# Altium project Currrent_Sense.PrjPCB
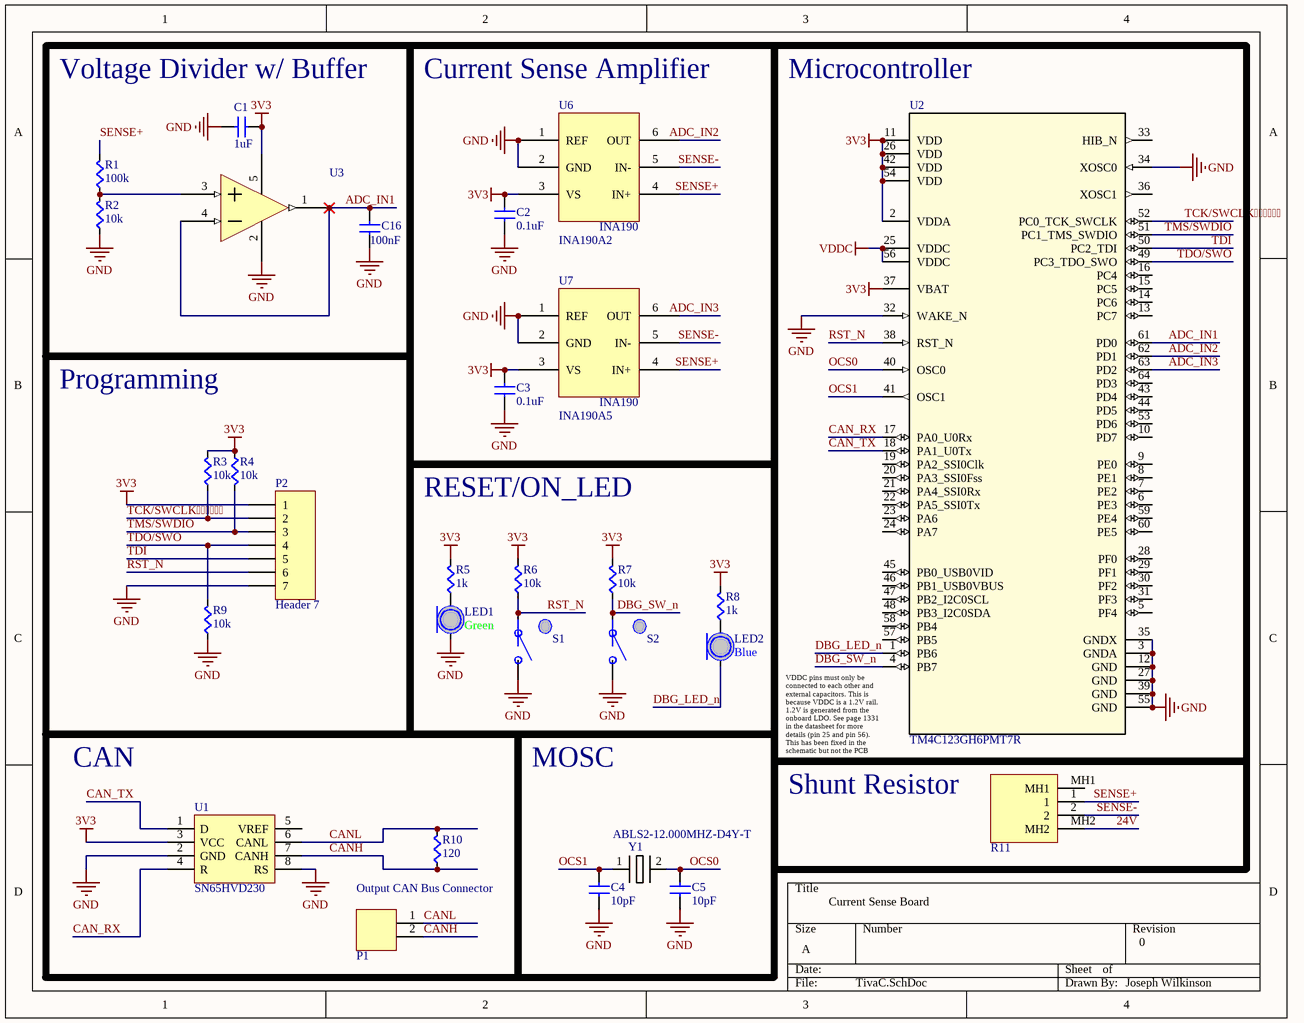
[diagram p0: TivaC.SchDoc]
2 sheets, 59 parts. Net scope: global (net labels, ports and power ports of the same name join across sheets).
Board file: Current_Sense_Board_V1.PcbDoc
Sheets:
  TivaC.SchDoc
  Power.SchDoc

## Sheet TivaC.SchDoc
size A

### Parts
C1  value 1uF  [CAPC0603]  (hidden comment: Cap)
C2  value 0.1uF  [CAPC0603]  (hidden comment: Cap)
C3  value 0.1uF  [CAPC0603]  (hidden comment: Cap)
C4  value 10pF  [CAPC0603]  (hidden comment: Cap)
C5  value 10pF  [CAPC0603]  (hidden comment: Cap)
C16  value 100nF  [CAPC0603]  (hidden comment: Cap)
LED1  Color: Green  [LED0603]  (hidden comment: LED)
LED2  Color: Blue  [LED0603]  (hidden comment: LED)
P1  2-pin Vert Sherlock  [MOLEX-HDR-1X2-SHERLOCK-VERT]  (value not drawn)
P2  Header 7  [HDR1X7]
R1  value 100k  [RES0603]  (hidden comment: Res)
R2  value 10k  [RES0603]  (hidden comment: Res)
R3  value 10k  [RES0603]  (hidden comment: Res)
R4  value 10k  [RES0603]  (hidden comment: Res)
R5  value 1k  [RES0603]  (hidden comment: Res)
R6  value 10k  [RES0603]  (hidden comment: Res)
R7  value 10k  [RES0603]  (hidden comment: Res)
R8  value 1k  [RES0603]  (hidden comment: Res)
R9  value 10k  [RES0603]  (hidden comment: Res)
R10  value 120  [RES0603]  (hidden comment: Res)
R11  SH6918F500BPEP  [SH6918F500BPEP]  (value not drawn)
S1  Button  [PTS645xxxxSMTR92]  (value not drawn)
S2  Button  [PTS645xxxxSMTR92]  (value not drawn)
U1  SN65HVD230  [SOIC-8pin]
U2  TM4C123GH6PMT7R  [TM4C123GH6PMT7R_L]
U3  MCP6L01  [MCP6L01R]  (value not drawn)
U6  INA190A2  [SC70 (DCK)]
U7  INA190A5  [SC70 (DCK)]
Y1  ABLS2-12.000MHZ-D4Y-T  [HC49/US]

### Blocks framed on the sheet
Voltage Divider w/ Buffer: C1 C16 R1 R2 U3
Current Sense Amplifier: C2 C3 U6 U7
Microcontroller: U2
Programming: P2 R3 R4 R9
RESET/ON_LED: LED1 LED2 R5-R8 S1 S2
CAN: P1 R10 U1
MOSC: C4 C5 Y1
Shunt Resistor: R11

### Nets
3V3: C1.2(B) C2.1(A) C3.1(A) P2.1 R3.1(A) R4.2(B) R5.1(A) R6.1(A) R7.1(A) R8.1(A) U1.3(VCC) U2.2(VDDA) U2.11(VDD) U2.26(VDD) U2.37(VBAT) U2.42(VDD) U2.54(VDD) U3.5(VDD) U6.3(VS) U7.3(VS)
GND: C1.1(A) C2.2(B) C3.2(B) C4.2(B) C5.2(B) C16.2(B) LED1.C P2.7 R2.2(B) R9.2(B) S1.B S2.B U1.2(GND) U1.8(RS) U2.3(GNDA) U2.12(GND) U2.27(GND) U2.32(WAKE_N) U2.34(XOSC0) U2.35(GNDX) U2.39(GND) U2.55(GND) U3.2(VSS) U6.1(REF) U6.2(GND) U7.1(REF) U7.2(GND)
VDDC: U2.25(VDDC) U2.56(VDDC)
24V: R11.MH2
ADC_IN1: C16.1(A) U2.61(PD0) U3.1(VOUT) U3.4(VIN-)
ADC_IN2: U2.62(PD1) U6.6(OUT)
ADC_IN3: U2.63(PD2) U7.6(OUT)
CAN_RX: U1.4(R) U2.17(PA0_U0Rx)
CAN_TX: U1.1(D) U2.18(PA1_U0Tx)
CANH: P1.2 R10.2(B) U1.7(CANH)
CANL: P1.1 R10.1(A) U1.6(CANL)
DBG_LED_n: LED2.C U2.1(PB6)
DBG_SW_n: R7.2(B) S2.A U2.4(PB7)
OCS0: C5.1(A) U2.40(OSC0) Y1.2
OCS1: C4.1(A) U2.41(OSC1) Y1.1
RST_N: P2.6 R6.2(B) S1.A U2.38(RST_N)
SENSE+: R1.1(A) R11.1 U6.4(IN+) U7.4(IN+)
SENSE-: R11.2 U6.5(IN-) U7.5(IN-)
TCK/SWCLK: P2.2 R3.2(B) U2.52(PC0_TCK_SWCLK)
TDI: P2.5 U2.50(PC2_TDI)
TDO/SWO: P2.4 R9.1(A) U2.49(PC3_TDO_SWO)
TMS/SWDIO: P2.3 R4.1(A) U2.51(PC1_TMS_SWDIO)
NetLED1_A: LED1.A R5.2(B)
NetLED2_A: LED2.A R8.2(B)
NetR1_2: R1.2(B) R2.1(A) U3.3(VIN+)

Not connected (* = marked no-connect by the designer): R11 MH1; U1 5(VREF); U2 5(PF4) 6(PE3) 7(PE2) 8(PE1) 9(PE0) 10(PD7) 13(PC7) 14(PC6) 15(PC5) 16(PC4) 19(PA2_SSI0Clk) 20(PA3_SSI0Fss) 21(PA4_SSI0Rx) 22(PA5_SSI0Tx) 23(PA6) 24(PA7) 28(PF0) 29(PF1) 30(PF2) 31(PF3) 33(HIB_N) 36(XOSC1) 43(PD4) 44(PD5) 45(PB0_USB0VID) 46(PB1_USB0VBUS) 47(PB2_I2C0SCL) 48(PB3_I2C0SDA) 53(PD6) 57(PB5) 58(PB4) 59(PE4) 60(PE5) 64(PD3)

### Notes on the sheet
- (near U2) VDDC pins must only be connected to each other and external capacitors. This is because VDDC is a 1.2V rail. 1.2V is generated from the onboard LDO. See page 1331 in the datasheet for more details (pin 25 and pin 56). This has been fixed in the schematic but not the PCB layout.
- Output CAN Bus Connector
- Current Sense Board
- 0
- Joseph Wilkinson

### Library data of the parts
P1 = MOLEX-HDR-1x2-SHERLOCK_VERT: Header, Molex, 2mm Pitch Sherlock Header, Single Row, Vertical, 2 Circuits, Length 3.3mm, 0353620250; Manufacturer Part Number: *; Order Part Number: *
P2 = Header 7: Header, 7-Pin; LatestRevisionDate: 17-Jul-2002; LatestRevisionNote: Re-released for DXP Platform.; Publisher: Altium Limited
R11 = SH6918F500BPEP: Copper bus bar with shunt resistor integrated; Manufacturer_Name: Ohmite; Height: 3.2mm; Manufacturer_Part_Number: SH6918F500BPEP; Mouser Part Number: 588-SH6918F500BPEP; Mouser Price/Stock: https://www.mouser.co.uk/ProductDetail/Ohmite/SH6918F500BPEP?qs=GedFDFLaBXHzBT0hI2BMgQ%3D%3D
S1 S2 = Button: SPST Button; Supplier 1: Digi-Key; Supplier Part Number 1: CKN9087CT-ND
U1 = SN65HVD230: 3.3V CAN Bus Transceiver
U2 = TM4C123GH6PMT7R: Imported; PartNumber: TM4C123GH6PMTR; Manufacturer: Texas Instruments; CompType: IC; PIN_COUNT: 64; Application_BuildNumber: *; Alternate_PartNumber: TM4C123GH6PMT; PackageReference: PM0064A; MountType: SMT; RoHS: Y; RefDes: RefDes; TYPE: TYPE; Value: Value
U3 = MCP6L01: Op Amp Rail-to-Rail 1Mhz; Supplier 1: Digi-Key; Supplier Part Number 1: MCP6L01T-E/OTCT-ND
U6 U7 = INA190
Y1 = ABLS2-12.000MHZ-D4Y-T: 12MHz ±30ppm Crystal 18pF 50 Ohm -40°C ~ 85°C Surface Mount HC49/US; Supplier 1: Digi-Key; Supplier Part Number 1: 535-9869-1-ND
C1-C5 C16 = Cap: Supplier 1: Digi-Key; Supplier Part Number 1: 1276-1000-1-ND
LED1 LED2 = LED: Supplier 1: Digi-Key; Supplier Part Number 1: 754-1122-1-ND
R1-R10 = Res: Supplier 1: Digi-Key; Supplier Part Number 1: RMCF0603JT10K0CT-ND

## Sheet Power.SchDoc
size A
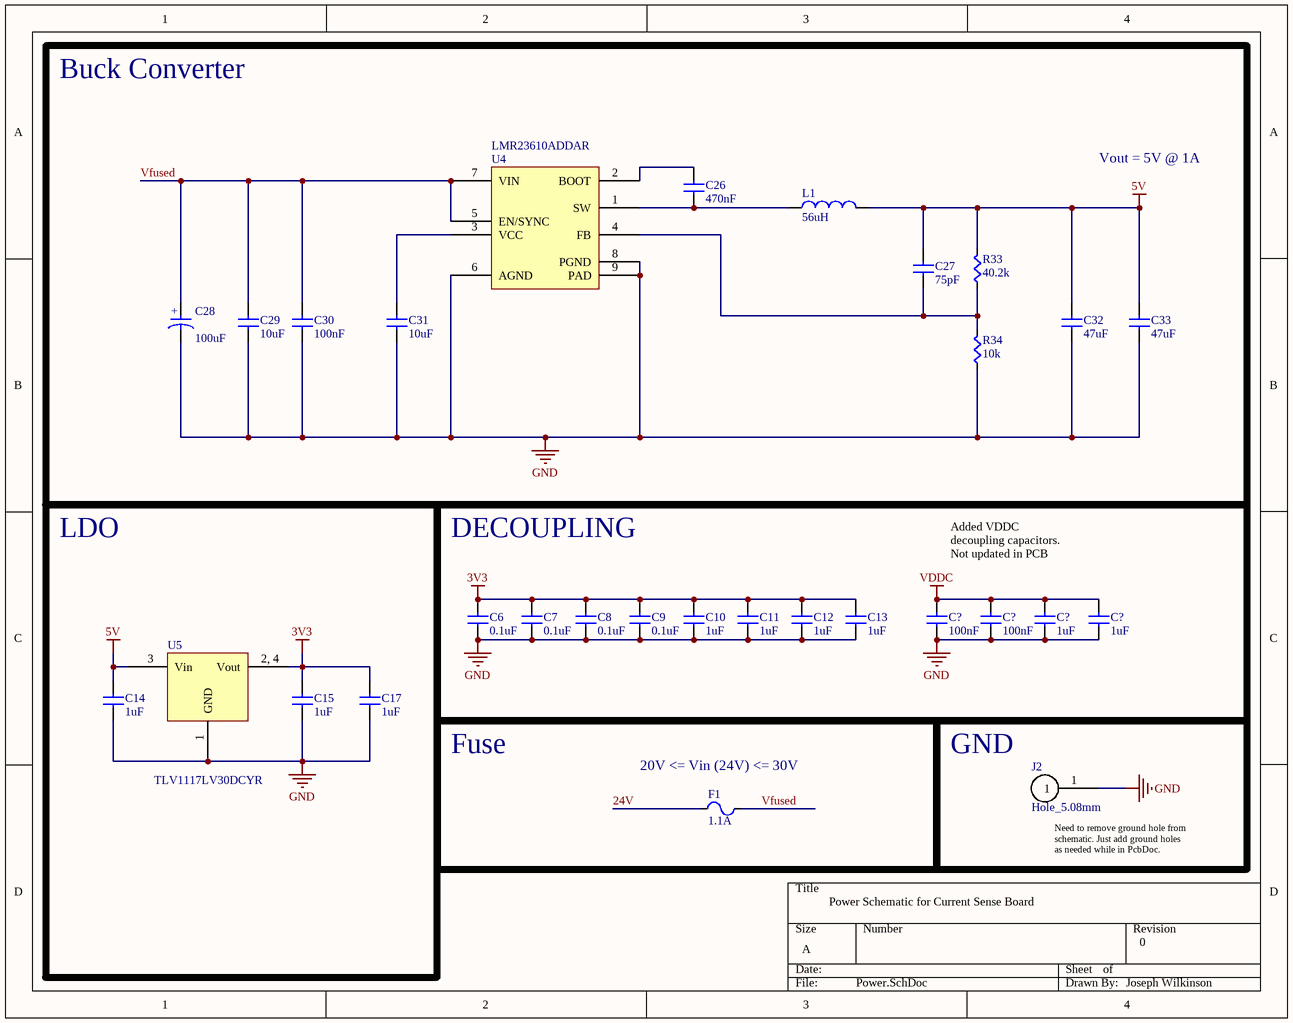
[diagram p1: Power.SchDoc]

### Parts
(Parts that share a designator on the sheet are numbered #1, #2 ... from top to bottom, then left to right.)
C6  value 0.1uF  [CAPC0603]  (hidden comment: Cap)
C7  value 0.1uF  [CAPC0603]  (hidden comment: Cap)
C8  value 0.1uF  [CAPC0603]  (hidden comment: Cap)
C9  value 0.1uF  [CAPC0603]  (hidden comment: Cap)
C10  value 1uF  [CAPC0603]  (hidden comment: Cap)
C11  value 1uF  [CAPC0603]  (hidden comment: Cap)
C12  value 1uF  [CAPC0603]  (hidden comment: Cap)
C13  value 1uF  [CAPC0603]  (hidden comment: Cap)
C14  value 1uF  [CAPC0603]  (hidden comment: Cap)
C15  value 1uF  [CAPC0603]  (hidden comment: Cap)
C17  value 1uF  [CAPC0603]  (hidden comment: Cap)
C26  value 470nF  [CAPC0603]  (hidden comment: Cap)
C27  value 75pF  [CAPC0603]  (hidden comment: Cap)
C28  value 100uF  [MAL215097101E3]  (hidden comment: MAL215097101E3)
C29  value 10uF  [CAPC1206]  (hidden comment: Cap)
C30  value 100nF  [CAPC0603]  (hidden comment: Cap)
C31  value 10uF  [CAPC1206]  (hidden comment: Cap)
C32  value 47uF  [CAP1210]  (hidden comment: Cap)
C33  value 47uF  [CAP1210]  (hidden comment: Cap)
C?#1  value 100nF  [CAPC0603]  (hidden comment: Cap)
C?#2  value 100nF  [CAPC0603]  (hidden comment: Cap)
C?#3  value 1uF  [CAPC0603]  (hidden comment: Cap)
C?#4  value 1uF  [CAPC0603]  (hidden comment: Cap)
F1  value 1.1A  [PTC7451X11N]  (hidden comment: PTC Fuse)
J2  Hole_5.08mm  [HOLE_5_08mm]
L1  value 56uH  [MSS1048-563MLB]  (hidden comment: MSS1048-563MLB)
R33  value 40.2k  [RES0603]  (hidden comment: Res)
R34  value 10k  [RES0603]  (hidden comment: Res)
U4  LMR23610ADDAR  [LMR23610ADDAR]
U5  TLV1117LV30DCYR  [SOT23-4N]

### Blocks framed on the sheet
Buck Converter: C26-C33 L1 R33 R34 U4
LDO: C14 C15 C17 U5
DECOUPLING: C6-C13 C?#1-C?#4
Fuse: F1
GND: J2

### Nets
3V3: C6.1(A) C7.1(A) C8.1(A) C9.1(A) C10.1(A) C11.1(A) C12.1(A) C13.1(A) C15.1(A) C17.1(A) U5.2,_4(Vout)
5V: C14.1(A) C27.1(A) C32.1(A) C33.1(A) L1.2 R33.1(A) U5.3(Vin)
GND: C6.2(B) C7.2(B) C8.2(B) C9.2(B) C10.2(B) C11.2(B) C12.2(B) C13.2(B) C14.2(B) C15.2(B) C17.2(B) C28.2 C29.2(B) C30.2(B) C31.2(B) C32.2(B) C33.2(B) C?#1.2(B) C?#2.2(B) C?#3.2(B) C?#4.2(B) J2.1 R34.2(B) U4.6(AGND) U4.8(PGND) U4.9(PAD) U5.1(GND)
VDDC: C?#1.1(A) C?#2.1(A) C?#3.1(A) C?#4.1(A)
24V: F1.1(A)
Vfused: C28.1 C29.1(A) C30.1(A) F1.2(B) U4.5(EN/SYNC) U4.7(VIN)
NetC26_1: C26.1(A) U4.2(BOOT)
NetC26_2: C26.2(B) L1.1 U4.1(SW)
NetC27_2: C27.2(B) R33.2(B) R34.1(A) U4.4(FB)
NetC31_1: C31.1(A) U4.3(VCC)

### Notes on the sheet
- Vout = 5V @ 1A
- Added VDDC decoupling capacitors. Not updated in PCB document.
- (near F1) 20V <= Vin (24V) <= 30V
- Power Schematic for Current Sense Board
- (near J2) Need to remove ground hole from schematic. Just add ground holes as needed while in PcbDoc.
- 0
- Joseph Wilkinson
- (in symbol MAL215097101E3) +

### Library data of the parts
F1 = PTC_Fuse: Supplier 1: Digi-Key; Supplier Part Number 1: 507-1744-1-ND
L1 = MSS1048-563MLB: FIXED IND 56UH 1.7A 126 MOHM; Manufacturer 1: Coilcraft; Manufacturer Part Number 1: MSS1048-563MLB; ComponentLink1Description: Web Site; ComponentLink1URL: https://www.coilcraft.com/mss1048.cfm; Supplier 1: Coilcraft; Supplier Part Number 1: MSS1048-563MLB
U4 = LMR23610ADDAR: IC REG BUCK ADJ 1A SYNC 8SOPWRPD; Manufacturer 1: Texas Instruments; Supplier 1: Digi-Key; Supplier Part Number 1: 296-47267-1-ND; Manufacturer Part Number 1: LMR23610ADDAR; ComponentLink1URL: http://www.ti.com/lit/ds/symlink/lmr23610.pdf; ComponentLink1Description: Datasheet; ComponentLink2URL: http://www.ti.com/product/LMR23610/description; ComponentLink2Description: Web Site
C6-C15 C17 C26 C27 C29-C33 C?#1-C?#4 = Cap: Supplier 1: Digi-Key
  C6-C15 C17 C30 C?#1-C?#4: Supplier Part Number 1: 1276-1000-1-ND
  C32 C33: Supplier Part Number 1: 490-6538-1-ND
R33 R34 = Res: Supplier 1: Digi-Key; Supplier Part Number 1: RMCF0603JT10K0CT-ND

## Nets that join several sheets
3V3: TivaC (20 pins), Power (11 pins)
GND: TivaC (27 pins), Power (27 pins)
VDDC: TivaC (U2.25 U2.56), Power (C?#1.1 C?#2.1 C?#3.1 C?#4.1)
24V: TivaC (R11.MH2), Power (F1.1)